# EAGLE design pneumatic-reg (EAGLE 7.5.0)
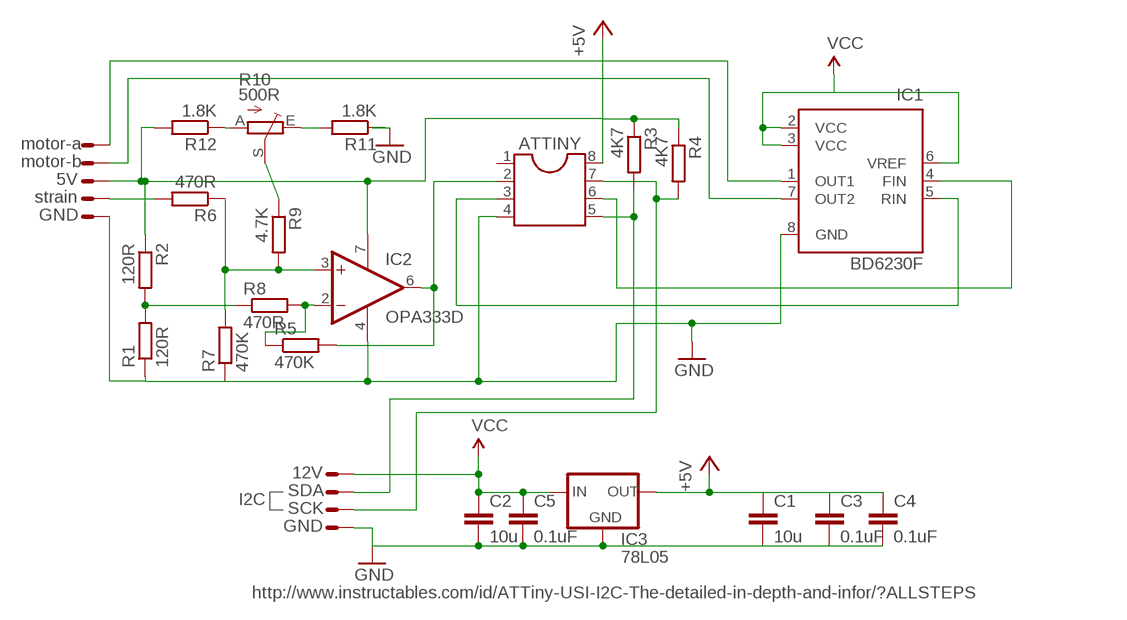
[diagram p0: schematic, sheet 1]

## Parts
ATTINY  DIL8  [DIL08]
C1  10u  C-EUC1206  [C1206]
C2  10u  C-EUC1206  [C1206]
C3  0.1uF  C-EUC1206  [C1206]
C4  0.1uF  C-EUC1206  [C1206]
C5  0.1uF  C-EUC1206  [C1206]
IC1  BD6230F  [SOP8]
IC2  OPA333D  [SO08]
IC3  78L05  78LXX  [78LXX]
R1  120R  R-EU_M0805  [M0805]
R2  120R  R-EU_M0805  [M0805]
R3  4K7  R-EU_M0805  [M0805]
R4  4K7  R-EU_M0805  [M0805]
R5  470K  R-EU_M0805  [M0805]
R6  470R  R-EU_M0805  [M0805]
R7  470K  R-EU_M0805  [M0805]
R8  470R  R-EU_M0805  [M0805]
R9  4.7K  R-EU_M0805  [M0805]
R10  500R  TRIM_1234-S64YW  [S64YW]
R11  1.8K  R-EU_M0805  [M0805]
R12  1.8K  R-EU_M0805  [M0805]
X2  22-23-2041  [22-23-2041]
X7  22-23-2051  [22-23-2051]

## Nets
+5V: ATTINY.8 C1.1 C3.1 C4.1 IC2.7(V+) IC3.OUT R2.1 R3.1 R4.1 R12.2 X7.3
D0: ATTINY.3 IC1.5(RIN)
D1: ATTINY.6 IC1.4(FIN)
GND: ATTINY.4 C1.2 C2.2 C3.2 C4.2 C5.2 IC1.8(GND) IC2.4(V-) IC3.GND R1.1 R7.1 X2.1 X7.1
N$2: R1.2 R2.2 R8.1
N$3: ATTINY.5 R3.2 X2.3
N$4: IC1.7(OUT2) X7.4
N$5: IC1.1(OUT1) X7.5
N$6: ATTINY.2 IC2.6(OUT) R5.2
N$8: IC2.2(-IN) R5.1 R8.2
N$9: ATTINY.7 R4.2 X2.2
N$10: R10.A R12.1
N$11: R6.2 X7.2
N$12: IC2.3(+IN) R6.1 R7.2 R9.2
N$13: R9.1 R10.S
N$14: R10.E
VCC: C2.1 C5.1 IC1.2(VCC) IC1.3(VCC) IC1.6(VREF) IC3.IN X2.4
Unconnected: ATTINY.1 R10.S@1(S) R11.1 R11.2

## Notes on the sheet
- motor-a
- motor-b
- 5V
- strain
- GND
- 12V
- SDA
- I2C
- SCK
- GND
- http://www.instructables.com/id/ATTiny-USI-I2C-The-detailed-in-depth-and-infor/?ALLSTEPS

## Library data of the parts
ATTINY = ic-package:DIL8: Dual In Line / Socket
C1-C5 = rcl:C-EU: CAPACITOR, European symbol
IC1 = rohm:BD623*F: H-bridge driver for brush motors Source: http://www.rohm.com/products/databook/motor/pdf/bd623x_series-e.pdf; MPN: BD6230F-E2; OC_FARNELL: 1716264; OC_NEWARK: 15R0529
IC2 = linear:OPA333: 1.8V, microPOWER CMOS OPERATIONAL AMPLIFIERS Zerø-Drift Series Source: Texas Instruments (Burr-Brown) .. U11 opa333 Operational Amp.pdf
IC3 = v-reg:78LXX: VOLTAGE REGULATOR
R1-R9 R11 R12 = rcl:R-EU_: RESISTOR, European symbol
R10 = pot:TRIM_1234-: POTENTIOMETER
X2 = con-molex:22-23-2041: .100" (2.54mm) Center Header - 4 Pin; MF: MOLEX; MPN: 22-23-2041; OC_FARNELL: 1462920; OC_NEWARK: 38C0355
X7 = con-molex:22-23-2051: .100" (2.54mm) Center Header - 5 Pin; MF: MOLEX; MPN: 22-23-2051; OC_FARNELL: 1462952; OC_NEWARK: 38C9178

## Board
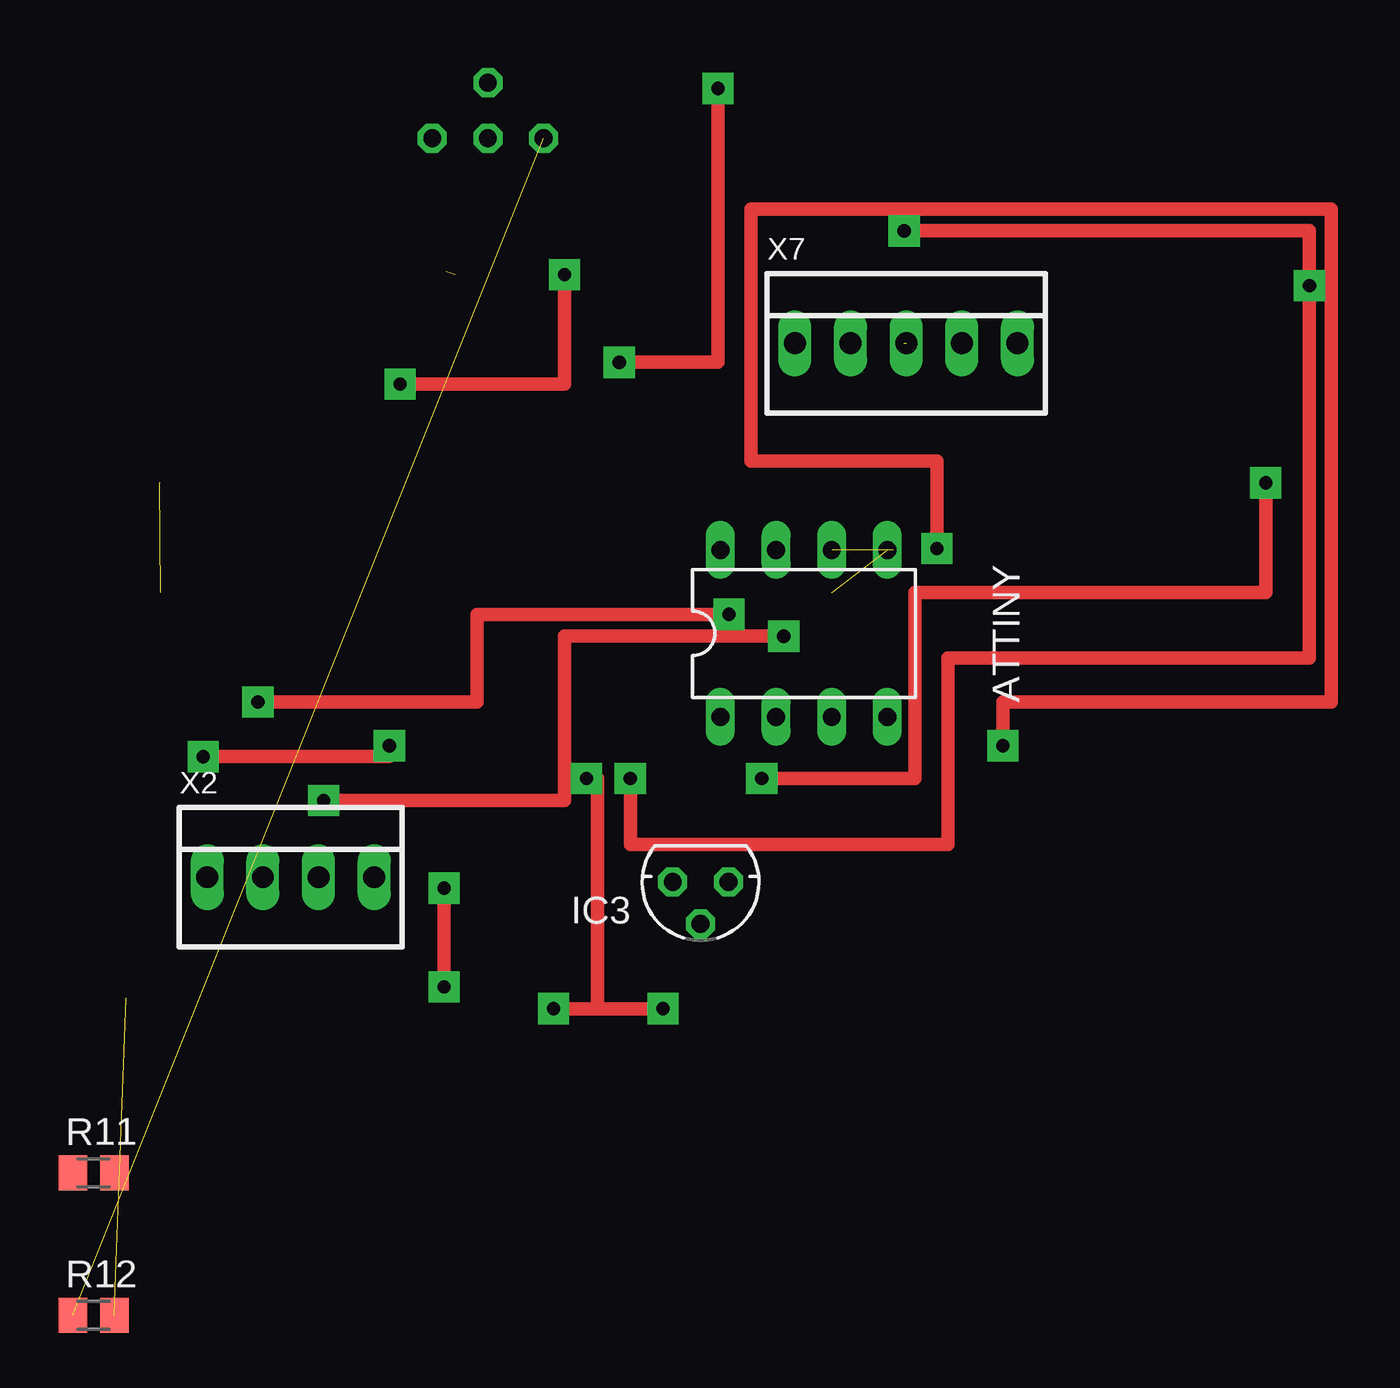
[diagram p1: board, top side]
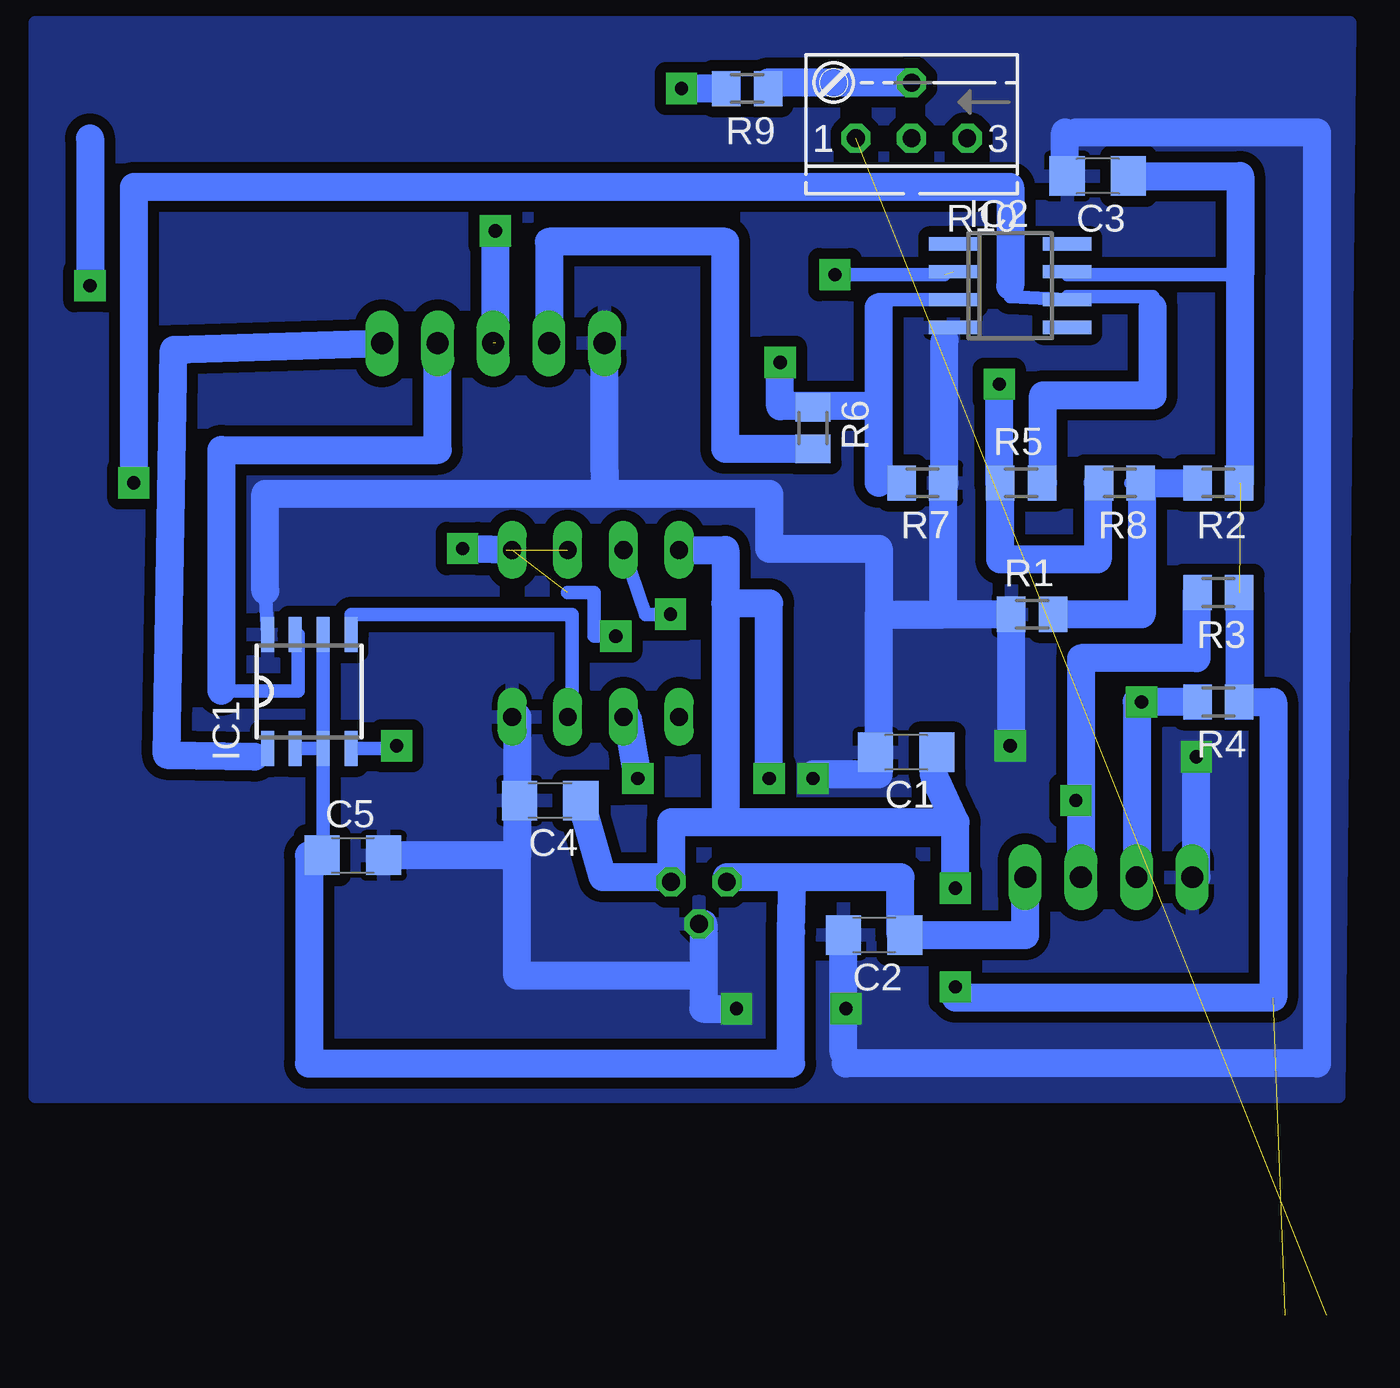
[diagram p2: board, bottom side, seen from below]

No outline drawn. Coordinates in mm, seen from the top.
Copper layers (1*16): Top 0.035mm / dielectric 1.5mm / Bottom 0.035mm
Design rules "default *": minimum track width 10mil, minimum drill 24mil, track to track 12mil, track to pad 12mil, pad to pad 12mil, via to via 12mil, smd to smd 8mil, copper to edge 40mil, drill to drill 8mil, minimum pad ring 10mil, minimum via ring 8mil, stop-mask expansion 4mil, vias tented up to drill 0mil, thermal gap 10mil

### Footprints (pad centres in the part's own frame; a part is rotated, then mirrored left to right if it is on the bottom)
DIL08 = drill 0.813 long: 1 -3.81,-3.81; 2 -1.27,-3.81; 3 1.27,-3.81; 4 3.81,-3.81; 5 3.81,3.81; 6 1.27,3.81; 7 -1.27,3.81; 8 -3.81,3.81
C1206 = smd 1.6 x 1.8: 1 -1.4,0; 2 1.4,0
SOP8 = smd 0.6 x 1.6: 1 -1.905,-2.6; 2 -0.635,-2.6; 3 0.635,-2.6; 4 1.905,-2.6; 5 1.905,2.6; 6 0.635,2.6; 7 -0.635,2.6; 8 -1.905,2.6
SO08 = smd 0.6 x 2.2: 1 -1.905,-2.6; 2 -0.635,-2.6; 3 0.635,-2.6; 4 1.905,-2.6; 5 1.905,2.6; 6 0.635,2.6; 7 -0.635,2.6; 8 -1.905,2.6
78LXX = drill 0.813 octagon: GND 0,1.905; IN 1.27,0; OUT -1.27,0
M0805 = smd 1.3 x 1.6: 1 -0.95,0; 2 0.95,0
S64YW = drill 0.813 octagon: A 2.54,1.27; E -2.54,1.27; S 0,-1.27; S@1 0,1.27
22-23-2041 = drill 1 long: 1 -3.81,0; 2 -1.27,0; 3 1.27,0; 4 3.81,0
22-23-2051 = drill 1 long: 1 -5.08,0; 2 -2.54,0; 3 0,0; 4 2.54,0; 5 5.08,0

### Placement (x,y rotation side)
ATTINY  33.42,19.63 0 top
C1  19.25,14.2 180 bottom
C2  20.7,5.86 180 bottom
C3  10.5,40.5 180 bottom
C4  35.5,12 180 bottom
C5  44.5,9.5 0 bottom
IC1  46.49,16.98 0 bottom
IC2  14.5,35.5 270 bottom
IC3  28.7,8.28 180 top
R1  13.5,20.5 0 bottom
R2  5,26.5 180 bottom
R3  5,21.5 180 bottom
R4  5,16.5 180 bottom
R5  14,26.5 0 bottom
R6  23.5,29 270 bottom
R7  18.5,26.5 180 bottom
R8  9.5,26.5 180 bottom
R9  26.5,44.5 180 bottom
R10  19,43.5 180 bottom
R11  1,-5 0 top
R12  1,-11.5 0 top
X2  10,8.5 0 top
X7  38.09,32.87 0 top

### Tracks (layer width: path | path; a pad name or v marks a point on that pad's centre or on a via)
+5V  (via drill 0.6 pad 1.42)  (4 unrouted)
  Top 0.61: v38,38 56.5,38 v56.5,35.5 56.5,18.5 40,18.5 40,10 25.5,10 v25.5,13 | v17,3.5 v17,8
  Bottom 0.61: 4,36 11.9,36 IC2.7 | C1.1 18,13.2 | 30,11 29.98,11 | IC3.OUT 30,8.28 30,8.5 | 17,3 v17,3.5
  Bottom 1.27: R3.1 R4.1 2.5,16.5 2.5,3 17,3 | C4.1 33.1,8.5 30,8.5 | 4,26.5 4,36 4,40.5 C3.1 | 18,13.2 17,11 | 17,11 27.5,11 | 27.5,11 29.98,11 IC3.OUT | ATTINY.8 27.5,23.44 27.5,21 | 27.5,21 27.5,11 | v17,8 17,11 | v25.5,13 25.5,21 27.5,21 | 38,32.87 v38,38 | 56.5,42.23 v56.5,35.5
D0
  Bottom 0.61: ATTINY.3 34.5,15.82 34.5,20.5 44.59,20.5 IC1.5
D1  (via drill 0.6 pad 1.42)  (1 unrouted)
  Top 0.61: v42.5,14.5 42.5,16.5 57.5,16.5 57.5,39 31,39 31,27.5 39.5,27.5 v39.5,23.5
  Bottom 0.61: IC1.4 42.5,14.38 v42.5,14.5
  Bottom 1.27: 37.5,23.44 v39.5,23.5
GND  (via drill 0.6 pad 1.42)
  Top 0.61: v23.5,13 24,13 24,2.5 | 24,2.5 v22,2.5 | v27,2.5 24,2.5 | v6,14 14.5,14 v14.5,14.5
  Bottom 0.61: IC1.8 48.5,21.58 | 33,27 33.02,27 | R7.1 17.5,26.5 | 17.5,33.5 17.1,33.5 IC2.4 17.5,33 | ATTINY.4 37,15.82 | C1.2 20.5,13.2 | 23.5,13.2 v23.5,13 | v22,2.5 22.11,2.5 C2.2 | v14.5,14.5 14.45,14.5 | C3.2 12,41 | 12,42.5 11.5,42.5 11.5,42.23 | 22,0 22,0.5 22.11,0.5 | IC3.GND 28.5,6.38 | C4.2 37,12.5
  Bottom 1.27: 48.5,21.58 48.5,26 33,26 | 33,26 33,27 | 33.02,27 X7.1 | 17.55,20.5 R1.1 14.45,14.5 | 17.55,20.5 R7.1 | 37,9.5 C5.2 | 37,15.82 37,12.5 37,9.5 | 20.5,20.5 20.5,13.2 23.5,13.2 | 20.5,20.5 17.55,20.5 | 33,26 25.5,26 25.5,23.5 20.5,23.5 20.5,20.5 | 28.5,4 28.5,2.5 v27,2.5 | 6,8.5 v6,14 | 12,41 12,42.5 | 11.5,42.5 0.5,42.5 0.5,0 22,0 | 22.11,0.5 C2.2 | 28.5,6.38 28.5,4 | 28.5,4 37,4 37,9.5 | 17.5,26.5 17.5,33
  pour Bottom (isolate 0.505, rank 6): -0.5,-1.5 59,-1.5 59,47.5 -1,47.5
N$2
  Bottom 0.61: 9,26.5 R8.1 8.5,26.5
  Bottom 1.27: R8.1 R2.2 | 8.5,26.5 8.5,20.5 R1.2
N$3  (via drill 0.6 pad 1.42)  (1 unrouted)
  Top 0.61: v11.5,12 22.5,12 22.5,19.5 v32.5,19.5
  Bottom 0.61: R3.2 6,21.5 | 11.5,18.5 11.27,18.5 | X2.3 11.5,8.5 v11.5,12 | v32.5,19.5 33.5,19.5 33.5,21.5 34.7,21.5
  Bottom 1.27: 6,21.5 6,18.5 11.27,18.5 X2.3
N$4
  Bottom 0.61: IC1.7 47,19.58 47,17 50.5,17 | 40.5,28 40.63,28
  Bottom 1.27: 50.5,17 50.5,28 40.63,28 X7.4
N$5
  Bottom 0.61: 49,14 IC1.1
  Bottom 1.27: X7.5 52.67,32.58 53,14.08 49,14
N$6  (via drill 0.6 pad 1.42)
  Top 0.61: v31.5,13 38.5,13 38.5,21.5 54.5,21.5 v54.5,26.5
  Bottom 0.61: R5.2 13,26.5 | ATTINY.2 32,15.82 | 8,34.5 8,35 11.9,35 IC2.6 14.5,35 14.5,35.5
  Bottom 1.27: 13,26.5 13,30.5 8,30.5 8,34.5 | v54.5,26.5 54.5,40 14.5,40 14.5,35.5 | 32,15.82 v31.5,13
N$8  (via drill 0.6 pad 1.42)  (1 unrouted)
  Top 0.61: v15,31 22.5,31 v22.5,36
  Bottom 0.61: R8.2 10.5,26.5 | 15,23 14.95,23 | R5.1 15,26.5 | v22.5,36 17.5,36
  Bottom 1.27: 10.5,26.5 10.5,23 14.95,23 R5.1 | 15,26.5 v15,31
N$9  (via drill 0.6 pad 1.42)
  Top 0.61: v8.5,16.5 18.5,16.5 18.5,20.5 v30,20.5
  Bottom 0.61: 8.73,16.5 v8.5,16.5 8.5,8.5 X2.2 | v30,20.5 31.16,20.5 ATTINY.7
  Bottom 1.27: R4.2 v8.5,16.5 | 8.73,16.5 X2.2
N$10  (1 unrouted)
N$11
  Bottom 1.27: R6.2 27.5,28.05 27.5,37.5 35.55,37.5 X7.2
N$12  (via drill 0.6 pad 1.42)
  Top 0.61: v29.5,44.5 29.5,32 v25,32
  Bottom 0.61: IC2.3 20.5,34.87 20.5,34.5 | R7.2 20.5,26.5 | 23,30 R6.1
  Bottom 1.27: 20.5,30 23,30 25,30 v25,32 | 20.5,26.5 20.5,30 | R9.2 v29.5,44.5 | 20.5,30 20.5,34.5
N$13
  Bottom 0.61: 25.55,44.77 R9.1
  Bottom 1.27: R10.S 25.55,44.77
VCC
  Bottom 0.61: IC1.3 IC1.2 | IC1.6 IC1.3 | IC1.3 45.86,9.5 C5.1 46.5,9.5 | 24.43,8.5 IC3.IN 27.43,8.5 | C2.1 19.5,5.86
  Bottom 1.27: C2.1 13.81,5.86 X2.4 | 46.5,9.5 46.5,0 24.5,0 24.5,6 24.43,8.5 | 19.5,5.86 19.5,8.5 24.43,8.5 | 24.43,8.5 27.43,8.5